# EAGLE schematic lowerkit (EAGLE 7.7.0)
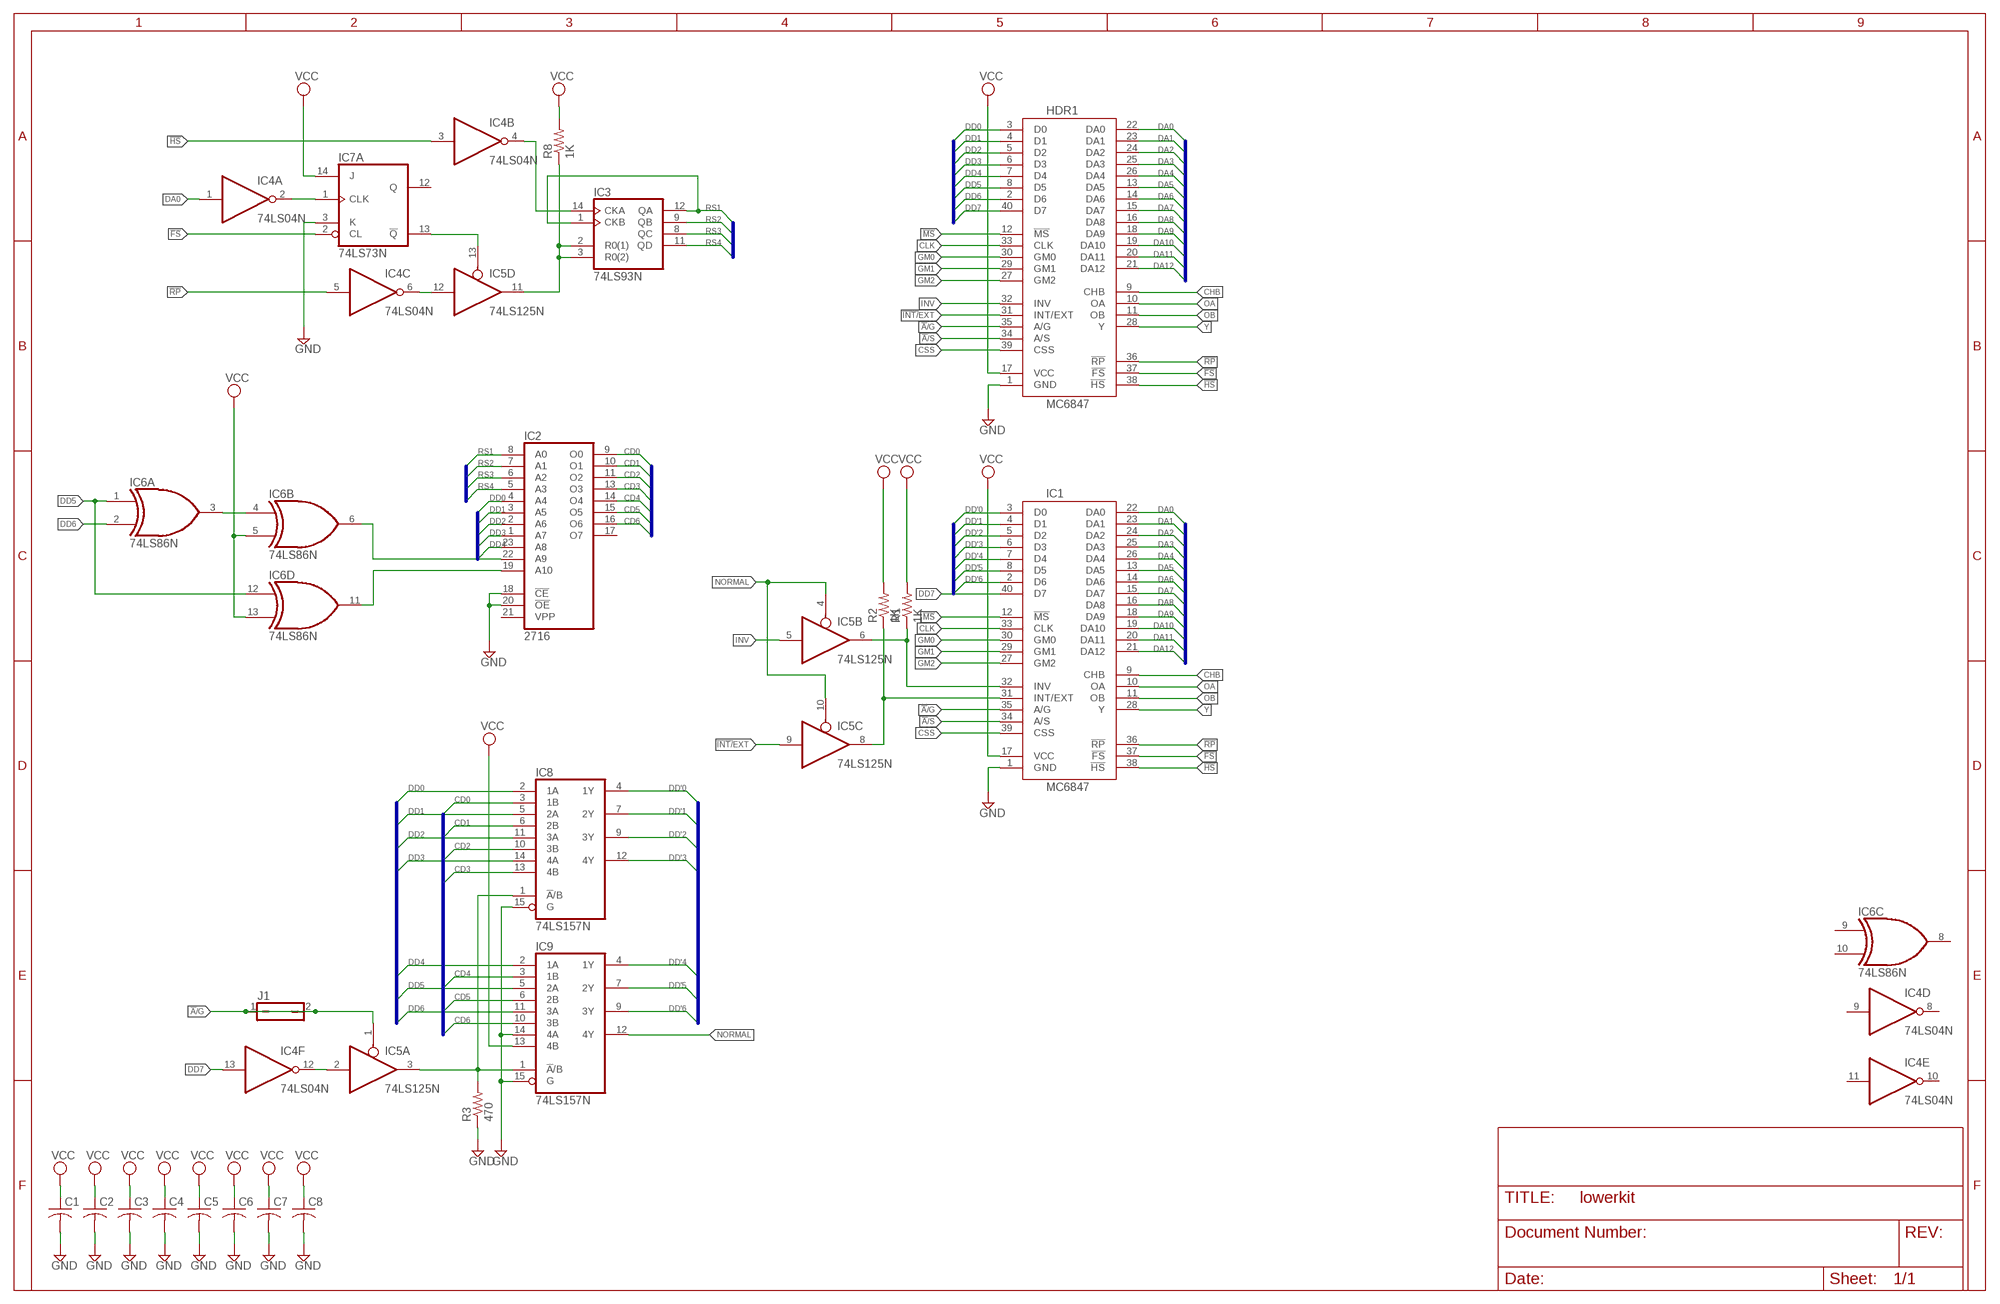
[diagram p0: schematic, sheet 1]

## Parts
C1  C-US025-025X050  [C025-025X050]
C2  C-US025-025X050  [C025-025X050]
C3  C-US025-025X050  [C025-025X050]
C4  C-US025-025X050  [C025-025X050]
C5  C-US025-025X050  [C025-025X050]
C6  C-US025-025X050  [C025-025X050]
C7  C-US025-025X050  [C025-025X050]
C8  C-US025-025X050  [C025-025X050]
HDR1  MC6847  [DIP-40]
IC1  MC6847  [DIP-40]
IC2  2716  [DIL24]
IC3  74LS93N  [DIL14-RP]
IC4  74LS04N  [DIL14-RP]
IC5  74LS125N  [DIL14-RP]
IC6  74LS86N  [DIL14-RP]
IC7  74LS73N  [DIL14-RP]
IC8  74LS157N  [DIL16-RP]
IC9  74LS157N  [DIL16-RP]
J1  JP1Q  [JP1]
R1  1K  R-US_0204/7  [0204/7]
R2  1K  R-US_0204/7  [0204/7]
R3  470  R-US_0204/7  [0204/7]
R8  1K  R-US_0204/7  [0204/7]

## Nets
!A!/G: HDR1.35(A/G) IC1.35(A/G) IC5.1(A:OE) J1.1 J1.2
!A!/S: HDR1.34(A/S) IC1.34(A/S)
!FS: HDR1.37(!FS) IC1.37(!FS) IC7.2(A:CL)
!HS: HDR1.38(!HS) IC1.38(!HS) IC4.3(B:I)
!INT/!EXT: HDR1.31(INT/EXT) IC5.9(C:I)
!MS: HDR1.12(!MS) IC1.12(!MS)
!RP: HDR1.36(!RP) IC1.36(!RP) IC4.5(C:I)
CD0: IC2.9(O0) IC8.3(1B)
CD1: IC2.10(O1) IC8.6(2B)
CD2: IC2.11(O2) IC8.10(3B)
CD3: IC2.13(O3) IC8.13(4B)
CD4: IC2.14(O4) IC9.3(1B)
CD5: IC2.15(O5) IC9.6(2B)
CD6: IC2.16(O6) IC9.10(3B)
CHB: HDR1.9(CHB) IC1.9(CHB)
CLK: HDR1.33(CLK) IC1.33(CLK)
CSS: HDR1.39(CSS) IC1.39(CSS)
DA0: HDR1.22(DA0) IC1.22(DA0) IC4.1(A:I)
DA1: HDR1.23(DA1) IC1.23(DA1)
DA2: HDR1.24(DA2) IC1.24(DA2)
DA3: HDR1.25(DA3) IC1.25(DA3)
DA4: HDR1.26(DA4) IC1.26(DA4)
DA5: HDR1.13(DA5) IC1.13(DA5)
DA6: HDR1.14(DA6) IC1.14(DA6)
DA7: HDR1.15(DA7) IC1.15(DA7)
DA8: HDR1.16(DA8) IC1.16(DA8)
DA9: HDR1.18(DA9) IC1.18(DA9)
DA10: HDR1.19(DA10) IC1.19(DA10)
DA11: HDR1.20(DA11) IC1.20(DA11)
DA12: HDR1.21(DA12) IC1.21(DA12)
DD0: HDR1.3(D0) IC2.4(A4) IC8.2(1A)
DD1: HDR1.4(D1) IC2.3(A5) IC8.5(2A)
DD2: HDR1.5(D2) IC2.2(A6) IC8.11(3A)
DD3: HDR1.6(D3) IC2.1(A7) IC8.14(4A)
DD4: HDR1.7(D4) IC2.23(A8) IC9.2(1A)
DD5: HDR1.8(D5) IC6.1(A:I0) IC6.12(D:I0) IC9.5(2A)
DD6: HDR1.2(D6) IC6.2(A:I1) IC9.11(3A)
DD7: HDR1.40(D7) IC1.40(D7) IC4.13(F:I)
DD'0: IC1.3(D0) IC8.4(1Y)
DD'1: IC1.4(D1) IC8.7(2Y)
DD'2: IC1.5(D2) IC8.9(3Y)
DD'3: IC1.6(D3) IC8.12(4Y)
DD'4: IC1.7(D4) IC9.4(1Y)
DD'5: IC1.8(D5) IC9.7(2Y)
DD'6: IC1.2(D6) IC9.9(3Y)
GM0: HDR1.30(GM0) IC1.30(GM0)
GM1: HDR1.29(GM1) IC1.29(GM1)
GM2: HDR1.27(GM2) IC1.27(GM2)
GND: C1.2 C2.2 C3.2 C4.2 C5.2 C6.2 C7.2 C8.2 HDR1.1(GND) IC1.1(GND) IC2.18(!CE) IC2.20(!OE) IC7.3(A:K) IC8.15(G) IC9.14(4A) IC9.15(G) R3.1
INV: HDR1.32(INV) IC5.5(B:I)
N$1: IC3.2(R0(1)) IC3.3(R0(2)) IC5.11(D:O) R8.1
N$2: IC4.6(C:O) IC5.12(D:I)
N$3: IC2.22(A9) IC6.6(B:O)
N$4: IC3.14(CKA) IC4.4(B:O)
N$5: IC5.13(D:OE) IC7.13(A:!Q)
N$6: IC2.19(A10) IC6.11(D:O)
N$7: IC6.3(A:O) IC6.4(B:I0)
N$8: IC1.32(INV) IC5.6(B:O) R1.1
N$9: IC4.2(A:O) IC7.1(A:CLK)
N$10: IC1.31(INT/EXT) IC5.8(C:O) R2.1
N$11: IC4.12(F:O) IC5.2(A:I)
N$12: IC5.3(A:O) IC8.1(!A!/B) IC9.1(!A!/B) R3.2
NORMAL: IC5.4(B:OE) IC5.10(C:OE) IC9.12(4Y)
OA: HDR1.10(OA) IC1.10(OA)
OB: HDR1.11(OB) IC1.11(OB)
RS1: IC2.8(A0) IC3.1(CKB) IC3.12(QA)
RS2: IC2.7(A1) IC3.9(QB)
RS3: IC2.6(A2) IC3.8(QC)
RS4: IC2.5(A3) IC3.11(QD)
VCC: C1.1 C2.1 C3.1 C4.1 C5.1 C6.1 C7.1 C8.1 HDR1.17(VCC) IC1.17(VCC) IC6.5(B:I1) IC6.13(D:I1) IC7.14(A:J) IC9.13(4B) R1.2 R2.2 R8.2
Y: HDR1.28(Y) IC1.28(Y)
Unconnected: IC2.17(O7) IC2.21(VPP) IC4.8(D:O) IC4.9(D:I) IC4.10(E:O) IC4.11(E:I) IC6.8(C:O) IC6.9(C:I0) IC6.10(C:I1) IC7.5(B:CLK) IC7.6(B:CL) IC7.7(B:J) IC7.8(B:!Q) IC7.9(B:Q) IC7.10(B:K) IC7.12(A:Q)

## Buses
DA[0..12]
DD[0..7]
RS[1..4]
CD[0..7]
DD'[0..7]

## Power pins joined to a net without a drawn wire
GND: IC2.12(GND) IC3.10(GND) IC4.7(P:GND) IC5.7(P:GND) IC6.7(P:GND) IC7.11(P:GND) IC8.8(GND) IC9.8(GND)
VCC: IC2.24(VCC) IC3.5(VCC) IC4.14(P:VCC) IC5.14(P:VCC) IC6.14(P:VCC) IC7.4(P:VCC) IC8.16(VCC) IC9.16(VCC)

## Library data of the parts
C1-C8 = resistor:C-US: CAPACITOR, American symbol
HDR1 IC1 = micro-motorola-rp:MC6847
IC2 = memory-rp:2716: MEMORY
IC3 = 74xx-us-jlb:74*93: Decade, divide by twelve and binary COUNTER
IC4 = 74xx-us-jlb:74*04: Hex INVERTER
IC5 = 74xx-us-jlb:74*125: Quad bus BUFFER, 3-state
IC6 = 74xx-us-jlb:74*86: Quad 2-input EXCLUSIV-OR (XOR) gate
IC7 = 74xx-us-jlb:74*73: Dual J-K FLIP FLOP, clear
IC8 IC9 = 74xx-us-jlb:74*157: Quadruple 2-line to 1-line data SELECTOR/MULTIPLEXER
J1 = jumper-jlb:JP1Q: JUMPER
R1-R3 R8 = resistor:R-US_: RESISTOR, American symbol